# EAGLE design CC2650_Protoboard (EAGLE 8.2.2)
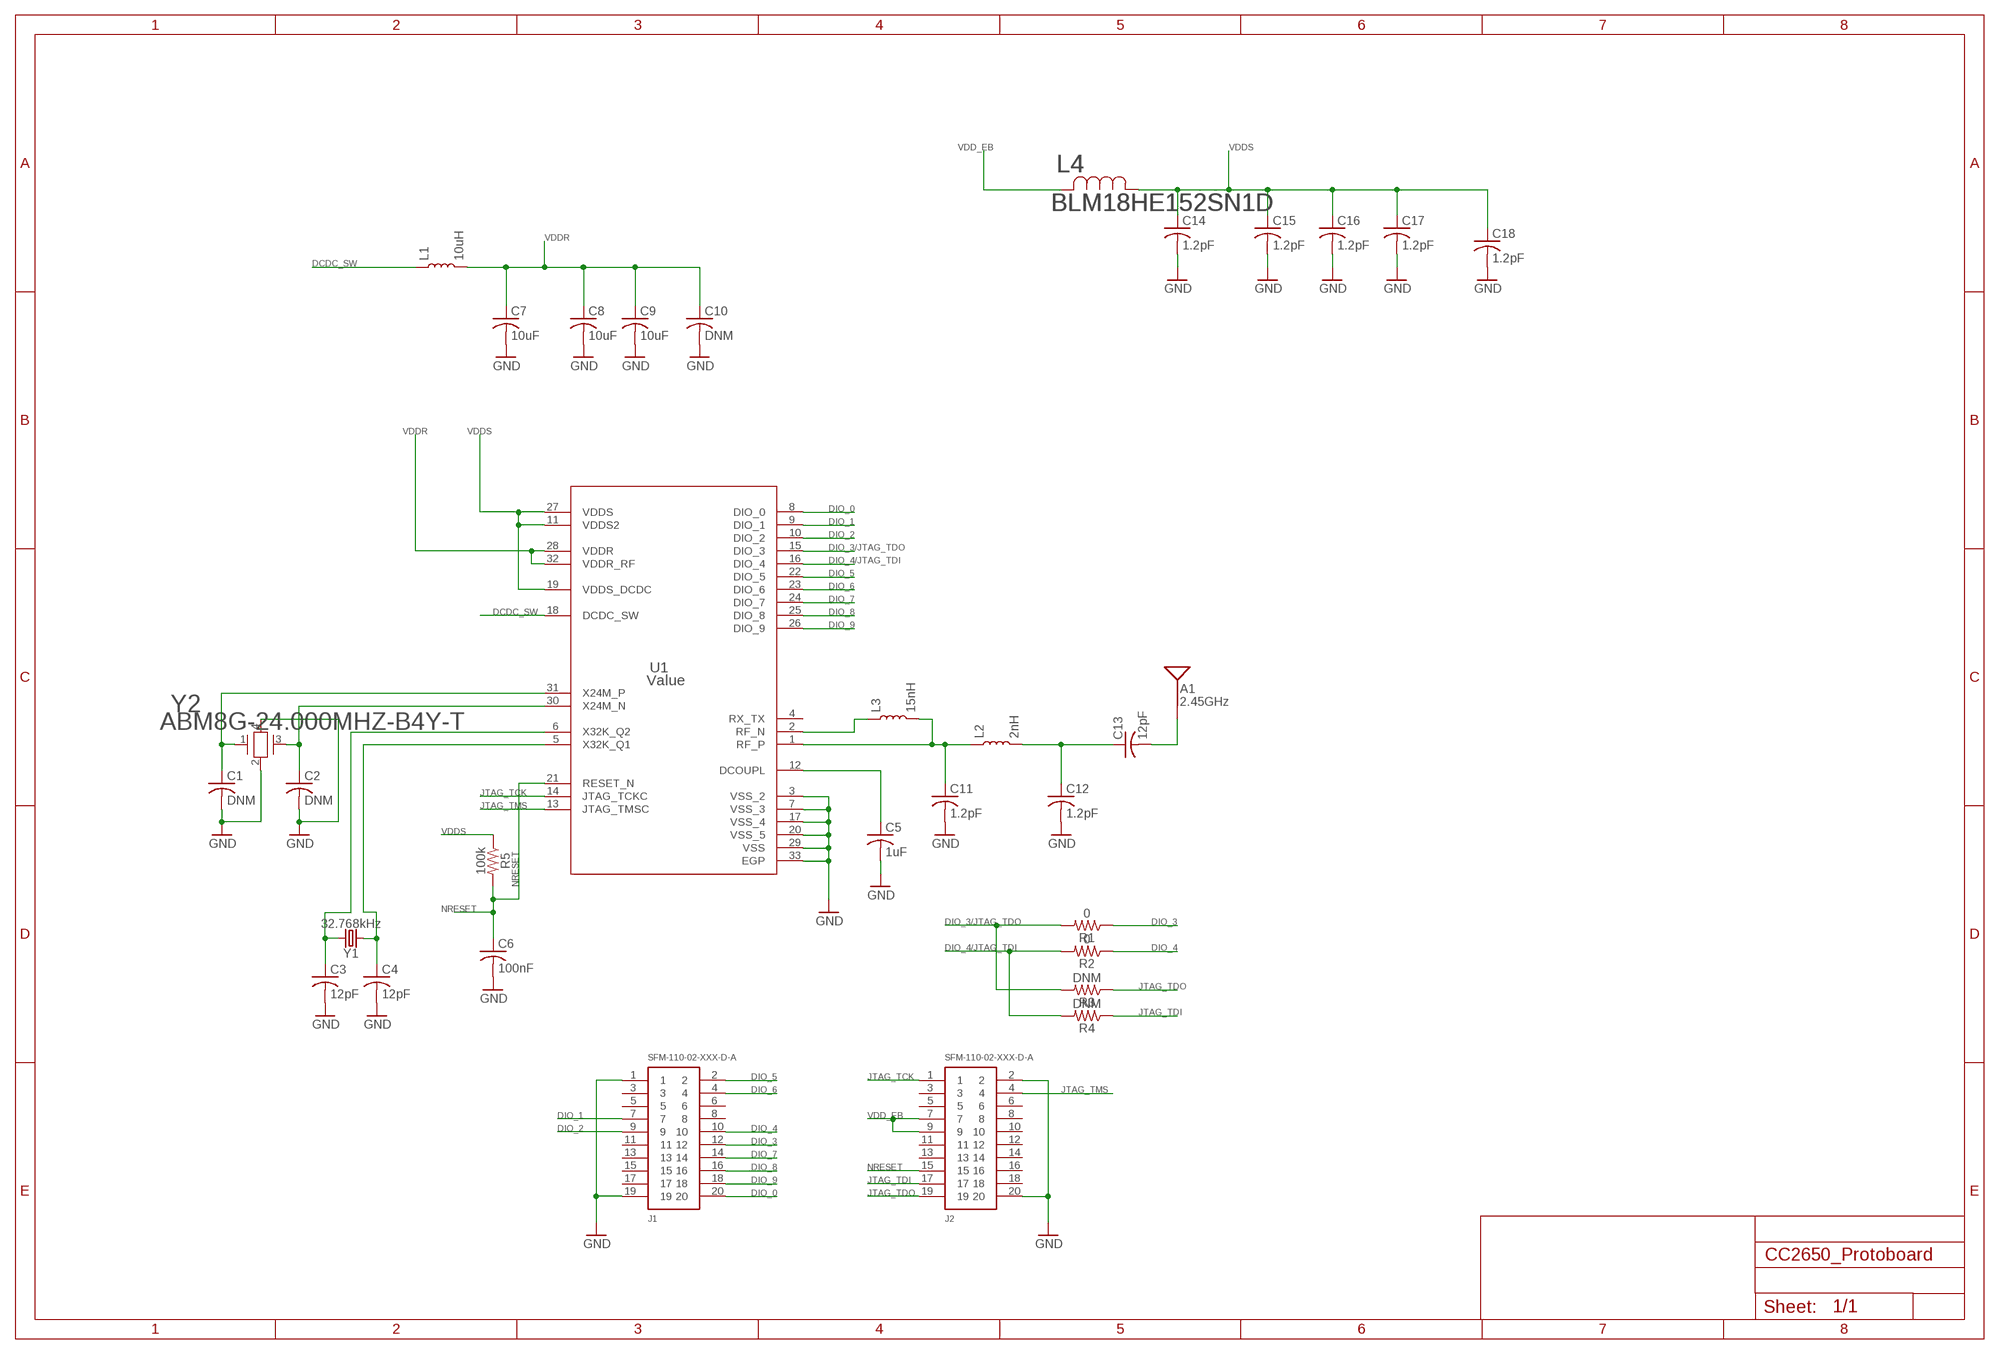
[diagram p0: schematic, sheet 1]

## Parts
A1  2.45GHz  ANTENNA2.4GHZ-6.5X2.2MM  [ANT-2.4GHZ-6.5X2.2MM]
C1  DNM  C-USC0402  [C0402]
C2  DNM  C-USC0402  [C0402]
C3  12pF  C-USC0402  [C0402]
C4  12pF  C-USC0402  [C0402]
C5  1uF  C-USC0402  [C0402]
C6  100nF  C-USC0402  [C0402]
C7  10uF  C-USC0402  [C0402]
C8  10uF  C-USC0402  [C0402]
C9  10uF  C-USC0402  [C0402]
C10  DNM  C-USC0402  [C0402]
C11  1.2pF  C-USC0402  [C0402]
C12  1.2pF  C-USC0402  [C0402]
C13  12pF  C-USC0402  [C0402]
C14  1.2pF  C-USC0402  [C0402]
C15  1.2pF  C-USC0402  [C0402]
C16  1.2pF  C-USC0402  [C0402]
C17  1.2pF  C-USC0402  [C0402]
C18  1.2pF  C-USC0402  [C0402]
J1  SFM-110-02-XXX-D-A  [SFM-110-02-XXX-D-A]
J2  SFM-110-02-XXX-D-A  [SFM-110-02-XXX-D-A]
L1  10uH  INDUCTOR-0402-3.9NH  [0402]
L2  2nH  INDUCTOR-0402-3.9NH  [0402]
L3  15nH  INDUCTOR-0402-3.9NH  [0402]
L4  BLM18HE152SN1D  [IND_BLM18_0603]
R1  0  0.05OHM-0603-1/5W-1%  [0603]
R2  0  0.05OHM-0603-1/5W-1%  [0603]
R3  DNM  0.05OHM-0603-1/5W-1%  [0603]
R4  DNM  0.05OHM-0603-1/5W-1%  [0603]
R5  100k  0.05OHM-0603-1/5W-1%  [0603]
U1  Value  CC2640R2FRSMR  [RSM0032B]
Y1  32.768kHz  CRYSTAL-32.768KHZSMD-3.2X1.5  [CRYSTAL-SMD-3.2X1.5MM]
Y2  ABM8G-24.000MHZ-B4Y-T  [CRYSTAL_ABM8G]

## Nets
DCDC_SW: L1.1 U1.18(DCDC_SW)
DIO_0: J1.20 U1.8(DIO_0)
DIO_1: J1.7 U1.9(DIO_1)
DIO_2: J1.9 U1.10(DIO_2)
DIO_3: J1.12 R1.1
DIO_3/JTAG_TDO: R1.2 R3.2 U1.15(DIO_3)
DIO_4: J1.10 R2.1
DIO_4/JTAG_TDI: R2.2 R4.2 U1.16(DIO_4)
DIO_5: J1.2 U1.22(DIO_5)
DIO_6: J1.4 U1.23(DIO_6)
DIO_7: J1.14 U1.24(DIO_7)
DIO_8: J1.16 U1.25(DIO_8)
DIO_9: J1.18 U1.26(DIO_9)
GND: C1.2 C2.2 C3.2 C4.2 C5.2 C6.2 C7.2 C8.2 C9.2 C10.2 C11.2 C12.2 C14.2 C15.2 C16.2 C17.2 C18.2 J1.1 J1.19 J2.2 J2.20 U1.3(VSS_2) U1.7(VSS_3) U1.17(VSS_4) U1.20(VSS_5) U1.29(VSS) U1.33(EGP) Y2.2 Y2.4
JTAG_TCK: J2.1 U1.14(JTAG_TCKC)
JTAG_TDI: J2.17 R4.1
JTAG_TDO: J2.19 R3.1
JTAG_TMS: J2.4 U1.13(JTAG_TMSC)
N$1: C3.1 U1.6(X32K_Q2) Y1.P$2
N$2: C4.1 U1.5(X32K_Q1) Y1.P$1
N$4: C2.1 U1.30(X24M_N) Y2.3
N$5: C1.1 U1.31(X24M_P) Y2.1
N$6: C5.1 U1.12(DCOUPL)
N$8: C11.1 L2.1 L3.2 U1.1(RF_P)
N$10: C12.1 C13.1 L2.2
N$11: A1.FEED(SIGNAL) C13.2
N$12: L3.1 U1.2(RF_N)
NRESET: C6.1 J2.15 R5.2 U1.21(RESET_N)
VDD_EB: J2.7 J2.9 L4.2
VDDR: C7.1 C8.1 C9.1 C10.1 L1.2 U1.28(VDDR) U1.32(VDDR_RF)
VDDS: C14.1 C15.1 C16.1 C17.1 C18.1 L4.1 R5.1 U1.11(VDDS2) U1.19(VDDS_DCDC) U1.27(VDDS)
Unconnected: J1.3 J1.5 J1.6 J1.8 J1.11 J1.13 J1.15 J1.17 J2.3 J2.5 J2.6 J2.8 J2.10 J2.11 J2.12 J2.13 J2.14 J2.16 J2.18 U1.4(RX_TX)

## Library data of the parts
A1 = SparkFun-RF:ANTENNA: Single-ended Antennae 2.4GHz and antennae with just one terminal. These are all chip antennae. 2.4GHz (WiFi/BT/ZigBee) Antennae ANT-2.4GHZ-6.5X2.2MM - 6.5 x 2.2 mm chip antenna. (SparkFun Product <https://www.sparkfun.com/products/144>) ANT-2.4GHZ8.0X1.0MM - 8.0 x 1.0 mm chip antenna. (Datasheet <http://www.mouser.com/ds/2/611/antenna_2500at44m0400-242425.pdf>) ANT-2.4GHZ9.5X2.0MM - 9.5 x 2.0 mm chip antenna. (SparkFun Product <https://www.sparkfun.com/products/9025>); PROD_ID: ANT-08187; SF_ID: WRL-00144
C1-C18 = rcl:C-US: CAPACITOR, American symbol
J1 J2 = SFM-110-02-XXX-D-A:SFM-110-02-XXX-D-A: 0.05"X0.05" SOCKET STRIP DOUBLE ROW ASSEMBLY. MANUFACTURER: SAMTEC.
L1-L3 = SparkFun-Coils:INDUCTOR: Inductors Resist changes in electrical current. Basically a coil of wire. SparkFun Products: SparkFun Load Cell Amplifier - HX711 <https://www.sparkfun.com/products/13879> IOIO-OTG - V2.2 <https://www.sparkfun.com/products/13613>; PROD_ID: NDUC-13457; VALUE: 3.9NH
L4 = MyLibrary - Components:BLM18HE152SN1D; MANUFACTURER_PART_NUMBER: BLM18HE152SN1D; VENDOR: MURATA
R1-R5 = SparkFun-Resistors:0.05OHM: 0.05Ω resistor A resistor is a passive two-terminal electrical component that implements electrical resistance as a circuit element. Resistors act to reduce current flow, and, at the same time, act to lower voltage levels within circuits. - Wikipedia; PROD_ID: RES-12535; VALUE: 0.05
U1 = MyLibrary - Microcontroller:CC2640R2FRSMR; MANUFACTURER: Texas Instruments; PARTNUMBER: CC2640R2FRSMR; REFDES: RefDes; TYPE: TYPE
Y1 = SparkFun-Clocks:CRYSTAL-32.768KHZ: 32.768kHz Crystal Frequency: 32.768kHz Frequency Stability: ±20ppm Load Capacitance: 12.5pF (PTH-2X6 & SMD-3.2X1.5), 6pF (SMD-2X6) SparkFun Products: SparkFun BigTime Watch Kit <https://www.sparkfun.com/products/11734> SparkFun nRF52832 Breakout <https://www.sparkfun.com/products/13990> SparkFun Real Time Clock Module <https://www.sparkfun.com/products/12708>; PROD_ID: XTAL-13062
Y2 = MyLibrary - Components:ABM8G-24.000MHZ-B4Y-T; MANUFACTURER_PART_NUMBER: ABM8G24.000MHZB4YT; VENDOR: Abracon

## Board
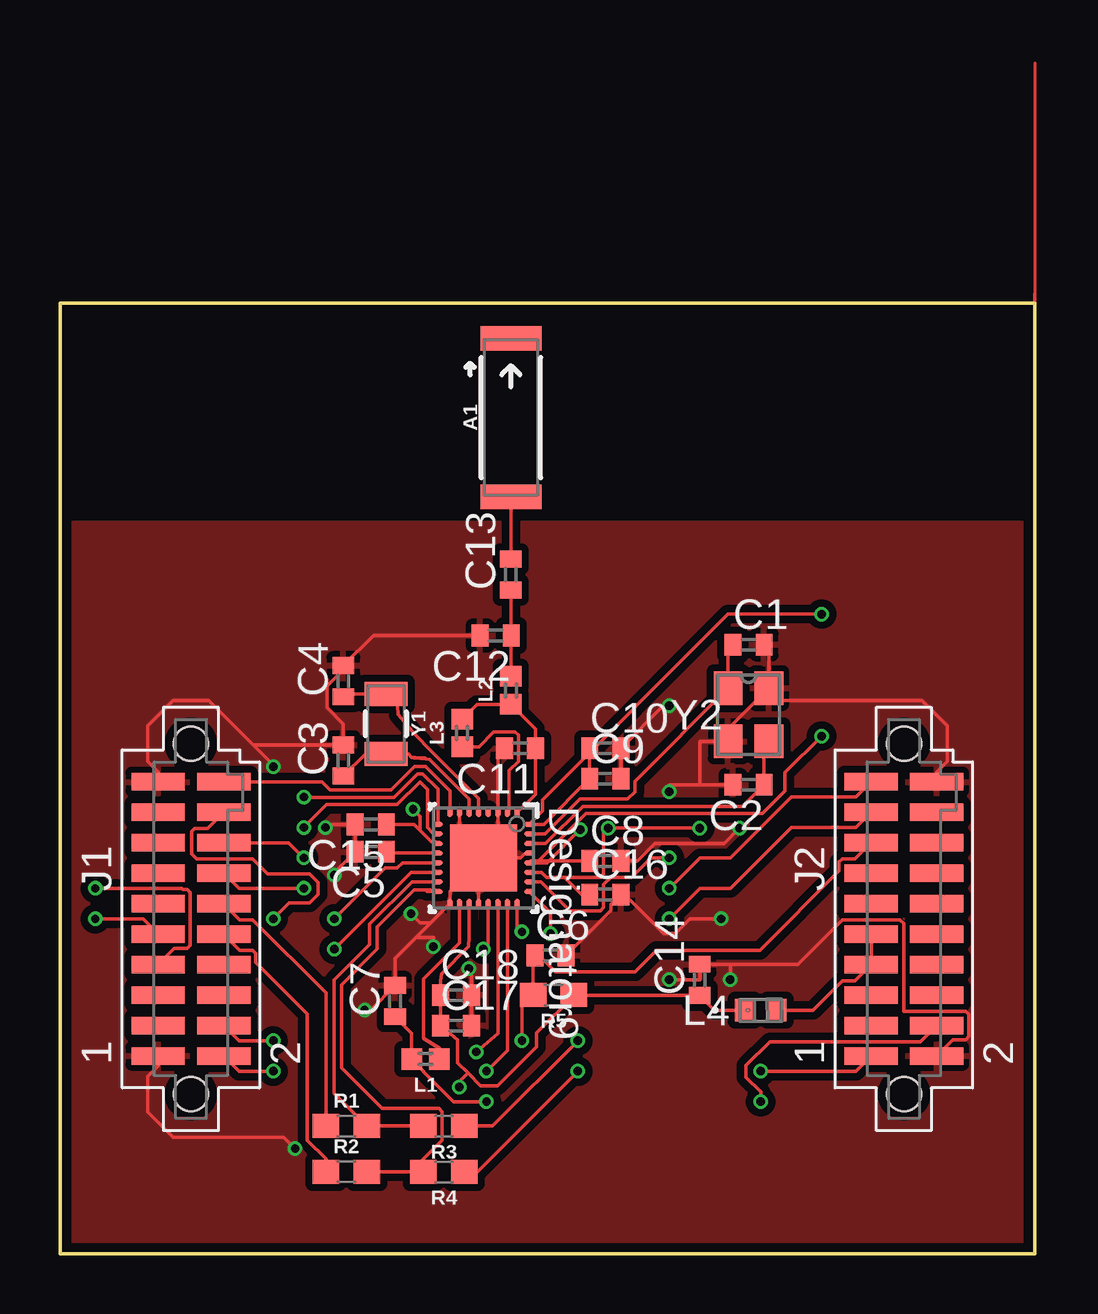
[diagram p1: board, top side]
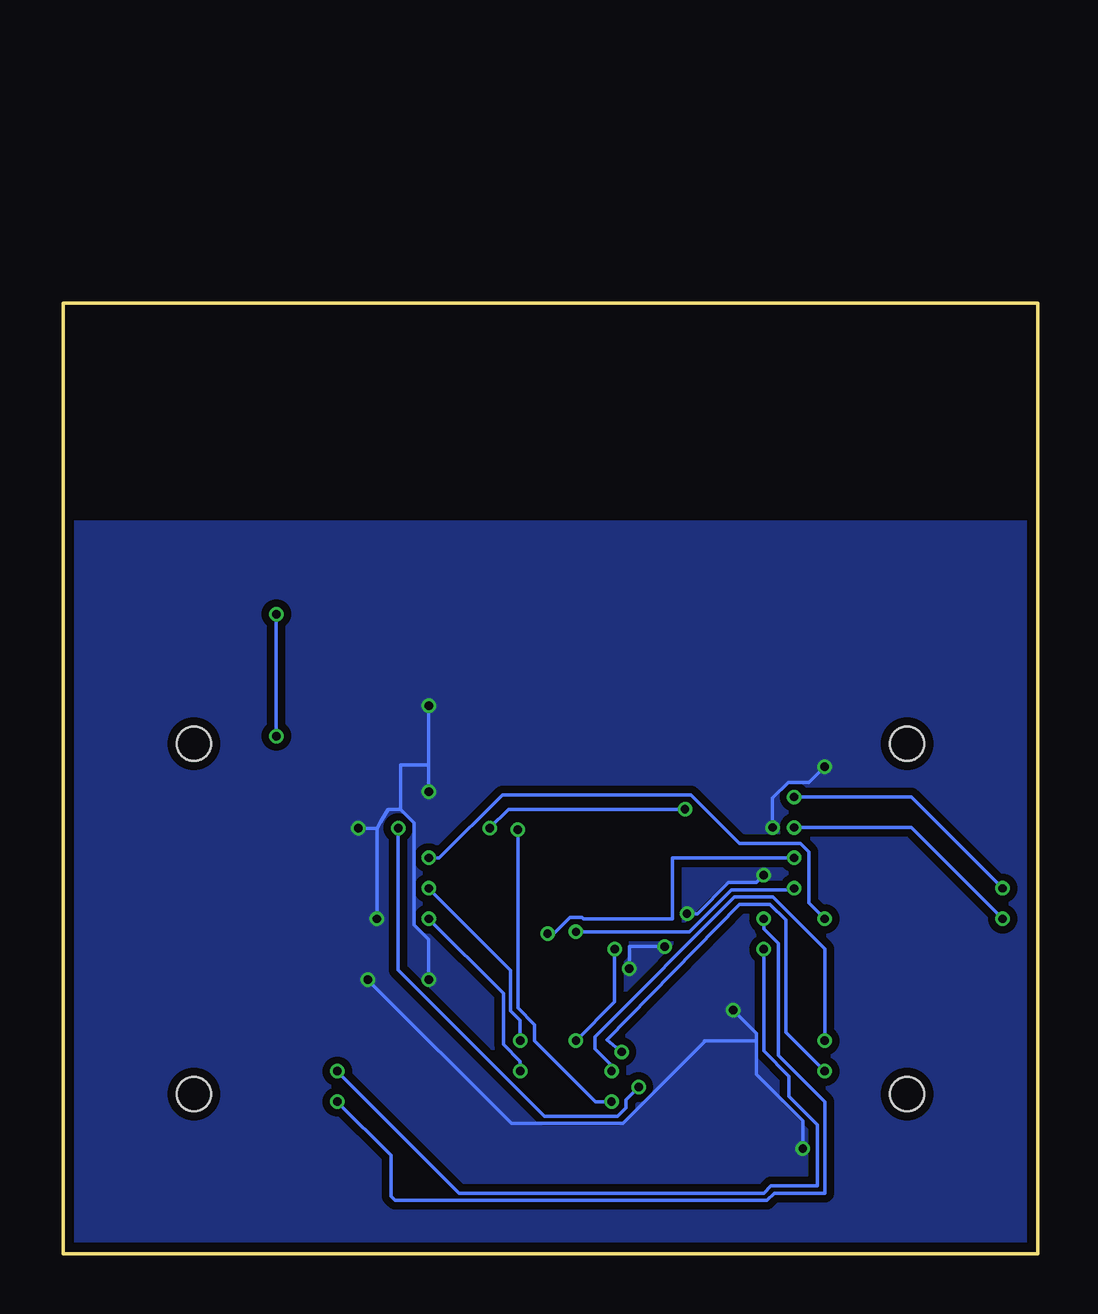
[diagram p2: board, bottom side, seen from below]

Size 40.64 x 39.64 mm. Coordinates in mm from the lower left corner, seen from the top.
Outline: 0,39.64 0,0 40.64,0 40.64,39.64 0,39.64
Copper layers (1*16): Top 0.035559375mm / dielectric 1.6mm / Bottom 0.035559375mm
Design rules "oshpark-2layer": minimum track width 6mil, minimum drill 10mil, track to track 6mil, track to pad 6mil, pad to pad 6mil, via to via 6mil, smd to smd 6mil, copper to edge 15mil, drill to drill 6mil, minimum pad ring 5mil, minimum via ring 5mil, stop-mask expansion 2.5mil, vias tented up to drill 0mil, thermal gap 10mil

### Footprints (pad centres in the part's own frame; a part is rotated, then mirrored left to right if it is on the bottom)
ANT-2.4GHZ-6.5X2.2MM = smd 1.016 x 2.54: FEED -3.302,0; NC 3.302,0
C0402 = smd 0.7 x 0.9: 1 -0.65,0; 2 0.65,0
SFM-110-02-XXX-D-A = smd 0.737 x 2.222: 1 5.715,-1.365; 2 5.715,1.365; 3 4.445,-1.365; 4 4.445,1.365; 5 3.175,-1.365; 6 3.175,1.365; 7 1.905,-1.365; 8 1.905,1.365; 9 0.635,-1.365; 10 0.635,1.365; 11 -0.635,-1.365; 12 -0.635,1.365; 13 -1.905,-1.365; 14 -1.905,1.365; 15 -3.175,-1.365; 16 -3.175,1.365; 17 -4.445,-1.365; 18 -4.445,1.365; 19 -5.715,-1.365; 20 -5.715,1.365 | hole 1.422: -7.303,0; 7.303,0
0402 = smd 0.85 x 0.9: 1 -0.58,0; 2 0.58,0
IND_BLM18_0603 = smd 0.813 x 0.94: 1 -0.673,0; 2 0.673,0
0603 = smd 1.1 x 1: 1 -0.85,0; 2 0.85,0
RSM0032B = smd 0.4 x 0.2: 1 -1.9,1.4; 2 -1.9,1; 3 -1.9,0.6; 4 -1.9,0.2; 5 -1.9,-0.2; 6 -1.9,-0.6; 7 -1.9,-1; 8 -1.9,-1.4; 17 1.9,-1.4; 18 1.9,-1; 19 1.9,-0.6; 20 1.9,-0.2; 21 1.9,0.2; 22 1.9,0.6; 23 1.9,1; 24 1.9,1.4 | smd 0.2 x 0.4: 9 -1.4,-1.9; 10 -1,-1.9; 11 -0.6,-1.9; 12 -0.2,-1.9; 13 0.2,-1.9; 14 0.6,-1.9; 15 1,-1.9; 16 1.4,-1.9; 25 1.4,1.9; 26 1,1.9; 27 0.6,1.9; 28 0.2,1.9; 29 -0.2,1.9; 30 -0.6,1.9; 31 -1,1.9; 32 -1.4,1.9 | smd 2.8 x 2.8: 33 0,0 | smd 0.5 x 0.5: V 0,-1.15
CRYSTAL-SMD-3.2X1.5MM = smd 1 x 1.8: P$1 -1.25,0; P$2 1.25,0
CRYSTAL_ABM8G = smd 1.194 x 1.397: 1 -0.851,1.105; 2 -0.851,-1.105; 3 0.851,-1.105; 4 0.851,1.105

### Placement (x,y rotation side)
A1  18.8,34.87 90 top
C1  28.7,25.4 0 top
C2  28.7,19.56 180 top
C3  11.81,20.57 90 top
C4  11.81,23.88 90 top
C5  12.95,16.76 180 top
C6  20.45,12.45 0 top
C7  13.97,10.54 90 top
C8  22.73,16.38 0 top
C9  22.73,19.81 0 top
C10  22.73,21.08 0 top
C11  19.18,21.08 180 top
C12  18.16,25.78 180 top
C13  18.8,28.32 90 top
C14  26.67,11.43 90 top
C15  12.95,17.91 180 top
C16  22.73,14.99 0 top
C17  16.51,9.53 0 top
C18  16.51,10.79 0 top
J1  5.46,13.97 270 top
J2  35.18,13.97 270 top
L1  15.24,8.13 180 top
L2  18.8,23.5 90 top
L3  16.76,21.72 90 top
L4  29.21,10.16 0 top
R1  11.94,5.33 0 top
R2  11.94,3.43 0 top
R3  16,5.33 180 top
R4  16,3.43 180 top
R5  20.57,10.79 180 top
U1  17.65,16.51 270 top
Y1  13.59,22.1 270 top
Y2  28.7,22.48 0 top

### Tracks (layer width: path | path; a pad name or v marks a point on that pad's centre or on a via)
DCDC_SW
  Top 0.152: U1.18 16.65,12.96 15.15,11.47 15.15,8.98 15.82,8.57 L1.1
DIO_0
  Top 0.152: U1.8 16.25,19.31 15.24,20.32 14.78,20.32 13.81,19.34 11.27,19.34 10.93,19.68 J1.20
DIO_1  (via drill 0.35)
  Top 0.152: U1.9 15.75,19.38 15.11,20.02 14.91,20.02 13.94,19.04 v10.17,19.04 v10.16,19.05 | v1.47,15.24 5.08,15.24 5.12,15.2 5.3,15.2 5.44,15.07 5.44,12.87 5.3,12.74 4.77,12.74 J1.7
  Bottom 0.152: v10.16,19.05 5.28,19.05 v1.47,15.24
DIO_2  (via drill 0.35)
  Top 0.152: U1.10 15.68,17.58 15.52,17.58 15.32,17.77 15.32,19.37 15.01,19.69 14.06,18.74 11.12,18.74 v10.16,17.78 | v1.47,13.97 3.46,13.97 J1.9
  Bottom 0.152: v10.16,17.78 5.28,17.78 v1.47,13.97
DIO_3
  Top 0.152: J1.12 7.5,13.93 8.03,13.93 11.09,10.88 R1.1
DIO_3/JTAG_TDO
  Top 0.152: R3.2 R1.2 11.43,6.69 11.43,11.43 12.92,12.92 12.92,13.75 14.67,15.51 U1.15
DIO_4
  Top 0.152: R2.1 11.09,3.96 10.31,4.74 10.31,10.01 8.17,12.15 8.17,12.53 8.03,12.66 7.5,12.66 J1.10
DIO_4/JTAG_TDI
  Top 0.152: 15.04,3.43 R4.2 | 15.04,3.43 R2.2 | 15.44,15.17 15.24,15.17 | 15.24,15.17 14.76,15.17 13.22,13.63 13.22,12.71 11.73,11.23 11.73,7.76 13.43,6.06 15.8,6.06 15.93,5.93 15.93,4.74 15.04,3.84 15.04,3.43 | 15.24,15.17 15.3,15.11 U1.16
DIO_5  (via drill 0.35)
  Top 0.152: U1.22 18.25,9.2 v17.36,8.43 | v8.89,7.62 7.46,7.62 J1.2
  Bottom 0.152: v8.89,7.62 10.52,9.25 10.52,13.92 11.18,14.58 12.44,14.58 17.96,8.93 v17.36,8.43
DIO_6  (via drill 0.35)
  Top 0.152: U1.23 18.65,8.49 v17.78,7.62 | v8.89,8.89 7.46,8.89 J1.4
  Bottom 0.152: v8.89,8.89 8.89,12.72 11.05,14.88 12.65,14.88 18.47,9.06 18.47,8.55 17.78,7.86 v17.78,7.62
DIO_7  (via drill 0.35)
  Top 0.152: U1.24 19.05,13.63 v19.26,13.43 | v10.16,15.24 7.46,15.24 J1.14
  Bottom 0.152: v10.16,15.24 10.21,15.19 12.77,15.19 14.53,13.43 v19.26,13.43
DIO_8  (via drill 0.35)
  Top 0.152: J1.16 9.53,17.14 v10.16,16.51 | v20.45,13.35 20.45,14.22 U1.25
  Bottom 0.152: v10.16,16.51 15.24,16.51 15.24,14.44 15.24,13.97 18.95,13.97 19.01,14.03 19.51,14.03 20.2,13.35 v20.45,13.35
DIO_9  (via drill 0.35)
  Top 0.152: J1.18 6.15,17.74 5.62,17.74 5.49,17.61 5.49,16.68 5.7,16.47 8.03,16.47 8.66,15.85 10.41,15.85 10.77,15.49 10.77,14.99 10.41,14.63 9.55,14.63 v8.89,13.97 | v25.4,16.51 24.63,16.51 23.83,15.7 22.96,15.7 22.66,15.41 22.66,14.44 22.53,14.31 21.25,14.31 20.05,15.51 U1.26
  Bottom 0.152: v8.89,13.97 9.55,14.63 9.55,16.76 9.91,17.12 12.44,17.12 14.47,19.14 22.33,19.14 24.96,16.51 v25.4,16.51
GND  (via drill 0.35)
  Top 0.152: J2.2 37.22,8.93 37.75,8.93 37.88,9.06 37.88,9.99 37.75,10.12 35.17,10.12 35.17,13.78 35.02,13.93 32.61,13.93 30.76,12.08 27.9,12.08 | 27.9,12.08 C14.2 26.67,11.43 v25.4,11.43 | 17.6,16.45 U1.33 | Y2.4 29.55,25.2 C1.2 | C12.2 13.07,25.78 C4.2 11.81,24.35 11.13,23.67 11.13,22.78 11.81,22.1 C3.2 8.06,21.22 | J1.19 4.1,20.09 3.66,20.53 3.66,22.02 4.71,23.08 6.21,23.08 8.06,21.22 | J1.1 4.1,7.85 3.66,7.41 3.66,5.92 4.71,4.86 9.33,4.86 v9.8,4.39 | v12.7,10.16 12.94,10.16 C7.2 13.97,12.33 14.83,13.19 | 14.83,13.19 15.45,13.81 | 15.45,13.81 U1.17 16.25,15.11 17.6,16.45 | C17.2 C18.2 17.16,12.02 v17.04,11.89 | v27.94,11.43 27.94,12.04 27.9,12.08 | v11.07,17.78 11.2,17.91 C15.2 C5.2 11.43,15.89 v11.43,15.79 | v8.89,20.32 8.89,20.39 8.06,21.22 | 22.65,14 22.97,14.31 22.97,14.57 C16.2 23.53,14.99 25.15,13.36 25.65,13.36 26.26,13.97 v27.56,13.97 | C6.2 22.65,14 | 22.65,14 | v25.4,22.86 25.16,22.86 C10.2 C9.2 | C8.2 24.07,16.38 24.81,17.12 27.69,17.12 v28.32,17.75 | v14.63,14.18 15.01,13.81 15.45,13.81 | v25.4,19.27 25.4,19.56 26.67,19.56 | 26.67,19.56 C2.2 | 26.67,19.56 26.67,21.37 Y2.2 27.85,21.88 Y2.4 | J2.20 36.54,20.09 36.98,20.53 36.98,22.02 35.93,23.08 30.06,23.08 Y2.4 | v15.57,12.82 15.57,13.19 14.83,13.19 | C11.2 18.25,21.08 U1.3 18.25,16.51 | U1.7 16.65,17.4 17.6,16.45 | U1.33 18.25,16.51 | 18.25,16.51 19.19,16.51 19.36,16.69 19.53,16.69 U1.29 | U1.20 17.45,16.51 U1.33
  Bottom 0.152: v9.8,4.39 9.8,5.56 11.73,7.49 11.73,8.88 | v12.7,10.16 11.73,9.2 11.73,8.88 | 13.86,8.89 13.91,8.84 | 13.91,8.84 17.31,5.44 21.95,5.44 v27.94,11.43 | v8.89,20.32 9.55,19.66 10.41,19.66 11.07,19 v11.07,17.78 | 27.56,17.75 v27.56,13.97 | 27.56,17.75 27.41,18 27.1,18.54 26.57,18.54 | 25.4,20.39 v25.4,19.27 | 25.4,20.39 v25.4,22.86 | v11.43,15.79 11.73,15.49 12.9,15.49 14.21,14.18 v14.63,14.18 | v25.4,11.43 25.4,13.11 26.01,13.72 26.01,17.98 26.57,18.54 | 26.57,18.54 26.57,20.39 25.4,20.39 | v28.32,17.75 27.56,17.75 | v17.04,11.89 17.04,12.82 v15.57,12.82 | 13.91,8.84 13.91,8.88 11.73,8.88
  pour Top (isolate 0.305): 0,30.48 0,0 40.64,0 40.64,30.48
  pour Bottom (isolate 0.305): 0,30.48 0,0 40.64,0 40.64,30.48
JTAG_TCK  (via drill 0.35)
  Top 0.152: 12.61,13.88 | 12.61,13.88 v11.43,12.7 | U1.14 14.64,15.91 12.61,13.88 | v29.21,7.62 33.18,7.62 J2.1
  Bottom 0.152: v11.43,12.7 11.43,8.46 10.38,7.4 10.38,6.57 9.2,5.38 9.2,2.85 11.12,2.85 11.43,2.54 24.13,2.54 v29.21,7.62
JTAG_TDI  (via drill 0.35)
  Top 0.152: R4.1 17.4,3.43 v21.59,7.62 | v25.4,13.97 26.67,15.24 27.94,15.24 30.48,17.78 33.18,17.78 J2.17
  Bottom 0.152: v25.4,13.97 22.29,10.86 22.29,8.73 21.59,8.03 v21.59,7.62
JTAG_TDO  (via drill 0.35)
  Top 0.152: R3.1 18.03,5.33 v21.59,8.89 | v25.4,15.24 26.67,16.51 27.94,16.51 30.48,19.05 33.18,19.05 J2.19
  Bottom 0.152: v25.4,15.24 21.98,11.82 21.98,10.12 21.59,9.73 v21.59,8.89
JTAG_TMS  (via drill 0.35)
  Top 0.152: v11.43,13.97 13.55,16.09 14.05,16.09 14.27,16.31 U1.13 | J2.4 35.87,8.85 29.58,8.85 28.6,7.87 28.6,7.37 29.21,6.76 v29.21,6.35
  Bottom 0.152: v11.43,13.97 11.43,13.56 10.82,12.95 10.82,8.28 8.89,6.35 8.89,2.54 11,2.54 11.3,2.23 26.8,2.23 26.98,2.41 26.98,4.12 v29.21,6.35
N$1
  Top 0.152: U1.6 17.05,18.96 15.4,20.62 15.26,20.63 | 15.26,20.63 14.77,20.67 | C3.1 12.73,20.85 Y1.P$2 14.52,20.85 14.66,20.7 14.68,20.7 14.69,20.69 14.8,20.69 14.92,20.68 15.21,20.68 15.26,20.63
N$2
  Top 0.152: U1.5 17.45,19 15.45,21 14.82,21.63 14.1,22.48 14.08,22.86 Y1.P$1 11.93,23.35 C4.1
N$4
  Top 0.152: Y2.3 29.35,21.17 C2.1 28.46,18.66 21.8,18.66 20.24,17.11 U1.30
N$5
  Top 0.152: C1.1 27.85,25.2 Y2.1 23.96,19.69 23.96,19.27 23.66,18.97 21.67,18.97 20.21,17.51 U1.31
N$6
  Top 0.152: U1.12 13.66,16.71 C5.1
N$8
  Top 0.152: U1.1 19.82,19.16 C11.1 19.83,21.88 L2.1 17.38,22.91 L3.2
N$10
  Top 0.152: L2.2 18.8,25.77 C12.1 18.81,27.66 C13.1
N$11
  Top 0.152: A1.FEED C13.2
N$12
  Top 0.152: U1.2 18.72,18.48 18.72,20.16 19.11,20.54 19.11,21.63 18.97,21.76 18.08,21.76 17.46,21.14 L3.1
NRESET  (via drill 0.35)
  Top 0.152: U1.21 17.85,12.91 v17.65,12.7 | v19.26,8.89 19.26,10.33 R5.2 19.72,12.37 C6.1 19.97,12.45 20.65,11.77 23.96,11.77 24.86,12.66 29.17,12.66 32.47,15.96 32.47,16.34 32.61,16.47 33.14,16.47 J2.15
  Bottom 0.152: v17.65,12.7 17.65,10.5 v19.26,8.89
VDD_EB
  Top 0.152: L4.2 31.38,10.16 32.61,11.39 33.14,11.39 J2.7 J2.9
VDDR  (via drill 0.35)
  Top 0.152: C10.1 C9.1 20.18,17.91 U1.32 20.11,18.47 20.11,18.93 27.85,26.67 v31.75,26.67 | C8.1 19.79,16.38 | 19.79,16.38 19.62,16.38 U1.28 20.3,16.31 v21.68,17.69 | 19.79,16.38 19.95,16.38 21.92,18.36 29.28,18.36 30.22,19.31 30.22,20.06 v31.75,21.59 | C7.1 14.66,9.2 L1.2 15.17,7.62 15.17,7.58 16.4,6.35 v17.78,6.35
  Bottom 0.152: v21.68,17.69 21.68,11.43 | 21.68,11.43 21.68,10.25 | v31.75,21.59 v31.75,26.67 | 21.68,11.43 21.68,10.25 | 21.68,10.25 20.98,9.55 20.98,8.89 18.44,6.35 v17.78,6.35
VDDS  (via drill 0.35)
  Top 0.152: C15.1 14.76,17.91 15.02,17.65 | L4.1 27.29,10.16 C14.1 21.44,10.78 | 21.44,10.78 R5.1 | U1.19 17.05,13.22 17.04,12.82 15.9,11.67 15.86,11.38 C18.1 C17.1 16.58,8.93 16.58,7.96 17,7.54 | 21.44,10.78 19.87,9.21 19.87,8.64 18.24,7.01 17.53,7.01 17,7.54 | v14.72,18.53 15.02,18.23 15.02,17.65 | U1.11 15.68,17.18 15.49,17.18 15.02,17.65 | 21.03,15.7 22.53,15.7 22.66,15.84 22.66,17.55 v22.86,17.75 v26.67,17.75 | 21.03,15.7 20.29,15.7 20.08,15.91 U1.27 | C16.1 21.75,14.99 21.03,15.7 | v16.65,6.96 16.65,7.19 17,7.54
  Bottom 0.152: v14.72,18.53 22.08,18.53 v22.86,17.75 | v16.65,6.96 17.17,6.43 17.17,6.1 17.53,5.74 20.57,5.74 26.67,11.84 v26.67,17.75
(copper drawn outside any net)
  shapes: Top area x2